# EAGLE design IOIO (EAGLE 5.11)
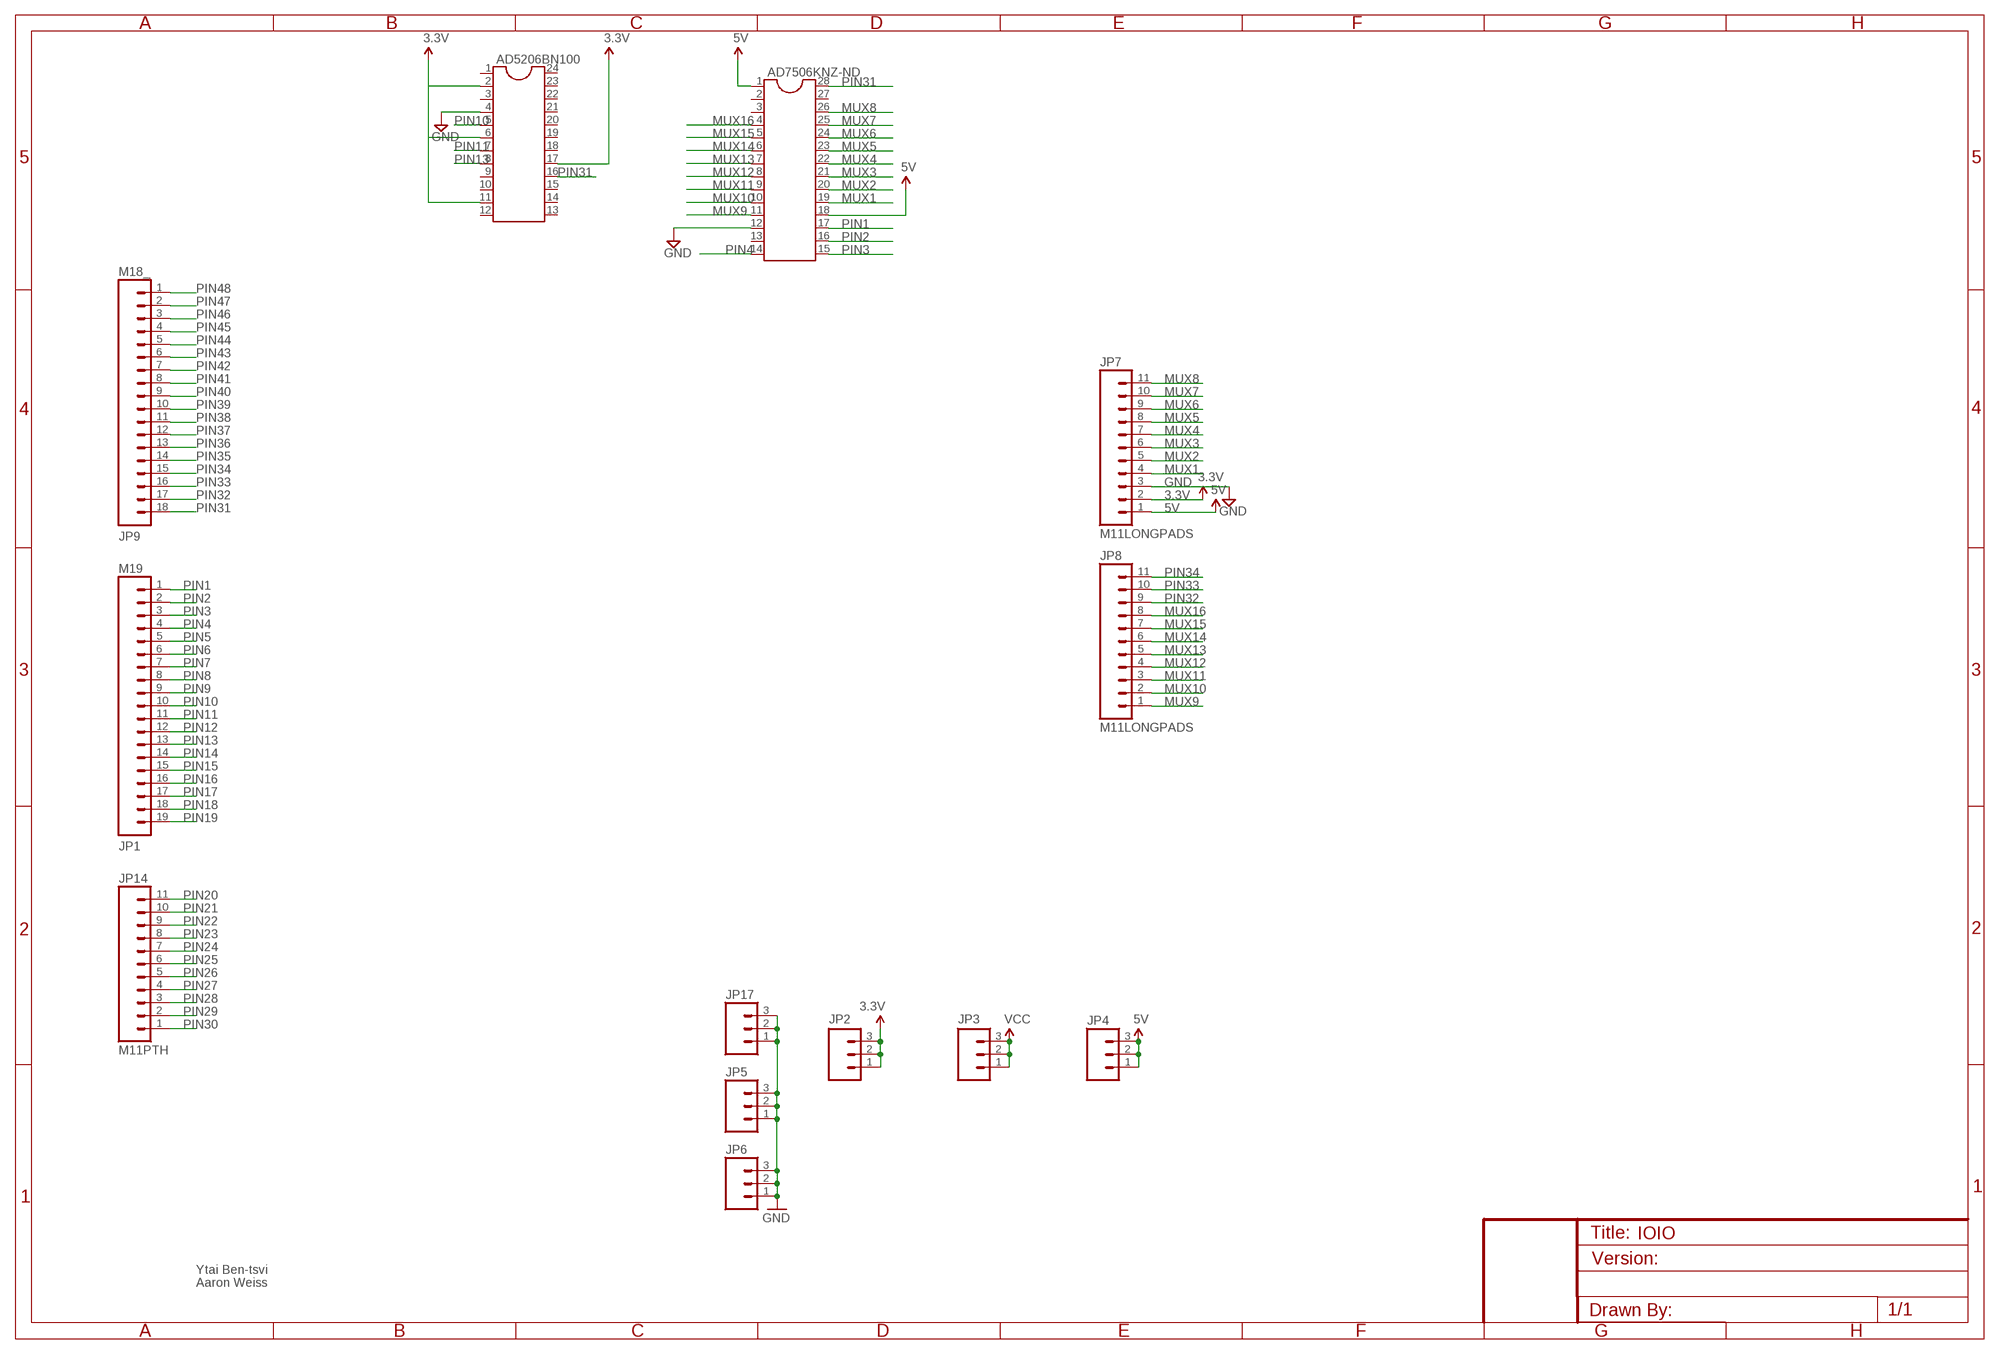
[diagram p0: schematic, sheet 1]

## Parts
AD5206BN100  DIL24-3  [DIL24-3]
AD7506KNZ-ND  DIL28  [DIL28-6]
JP1  M19  [1X19]
JP2  M03PTH  [1X03]
JP3  M03PTH  [1X03]
JP4  M03PTH  [1X03]
JP5  M03PTH  [1X03]
JP6  M03PTH  [1X03]
JP7  M11LONGPADS  [1X11_LONGPADS]
JP8  M11LONGPADS  [1X11_LONGPADS]
JP9  M18_  [1X18]
JP14  M11PTH  [1X11]
JP17  M03PTH  [1X03]

## Nets
3.3V: AD5206BN100.2 AD5206BN100.6 AD5206BN100.11 AD5206BN100.17 JP2.1 JP2.2 JP2.3 JP7.2
5V: AD7506KNZ-ND.1 AD7506KNZ-ND.18 JP4.1 JP4.2 JP4.3 JP7.1
GND: AD5206BN100.4 AD7506KNZ-ND.12 JP5.1 JP5.2 JP5.3 JP6.1 JP6.2 JP6.3 JP7.3 JP17.1 JP17.2 JP17.3
MUX1: AD7506KNZ-ND.19 JP7.4
MUX2: AD7506KNZ-ND.20 JP7.5
MUX3: AD7506KNZ-ND.21 JP7.6
MUX4: AD7506KNZ-ND.22 JP7.7
MUX5: AD7506KNZ-ND.23 JP7.8
MUX6: AD7506KNZ-ND.24 JP7.9
MUX7: AD7506KNZ-ND.25 JP7.10
MUX8: AD7506KNZ-ND.26 JP7.11
MUX9: AD7506KNZ-ND.11 JP8.1
MUX10: AD7506KNZ-ND.10 JP8.2
MUX11: AD7506KNZ-ND.9 JP8.3
MUX12: AD7506KNZ-ND.8 JP8.4
MUX13: AD7506KNZ-ND.7 JP8.5
MUX14: AD7506KNZ-ND.6 JP8.6
MUX15: AD7506KNZ-ND.5 JP8.7
MUX16: AD7506KNZ-ND.4 JP8.8
PIN1: AD7506KNZ-ND.17 JP1.1
PIN2: AD7506KNZ-ND.16 JP1.2
PIN3: AD7506KNZ-ND.15 JP1.3
PIN4: AD7506KNZ-ND.14 JP1.4
PIN5: JP1.5
PIN6: JP1.6
PIN7: JP1.7
PIN8: JP1.8
PIN9: JP1.9
PIN10: AD5206BN100.5 JP1.10
PIN11: AD5206BN100.7 JP1.11
PIN12: JP1.12
PIN13: AD5206BN100.8 JP1.13
PIN14: JP1.14
PIN15: JP1.15
PIN16: JP1.16
PIN17: JP1.17
PIN18: JP1.18
PIN19: JP1.19
PIN20: JP14.11
PIN21: JP14.10
PIN22: JP14.9
PIN23: JP14.8
PIN24: JP14.7
PIN25: JP14.6
PIN26: JP14.5
PIN27: JP14.4
PIN28: JP14.3
PIN29: JP14.2
PIN30: JP14.1
PIN31: AD5206BN100.16 AD7506KNZ-ND.28 JP9.18
PIN32: JP8.9 JP9.17
PIN33: JP8.10 JP9.16
PIN34: JP8.11 JP9.15
PIN35: JP9.14
PIN36: JP9.13
PIN37: JP9.12
PIN38: JP9.11
PIN39: JP9.10
PIN40: JP9.9
PIN41: JP9.8
PIN42: JP9.7
PIN43: JP9.6
PIN44: JP9.5
PIN45: JP9.4
PIN46: JP9.3
PIN47: JP9.2
PIN48: JP9.1
VCC: JP3.1 JP3.2 JP3.3
Unconnected: AD5206BN100.1 AD5206BN100.3 AD5206BN100.9 AD5206BN100.10 AD5206BN100.12 AD5206BN100.13 AD5206BN100.14 AD5206BN100.15 AD5206BN100.18 AD5206BN100.19 AD5206BN100.20 AD5206BN100.21 AD5206BN100.22 AD5206BN100.23 AD5206BN100.24 AD7506KNZ-ND.2 AD7506KNZ-ND.3 AD7506KNZ-ND.13 AD7506KNZ-ND.27

## Notes on the sheet
- Ytai Ben-tsvi
- Aaron Weiss

## Library data of the parts
AD5206BN100 = ic-package:DIL24: Dual In Line
AD7506KNZ-ND = ic-package:DIL28: Dual In Line
JP1 = SparkFun:M19
JP2-JP6 JP17 = SparkFun:M03: Header 3 Standard 3-pin 0.1" header. Use with straight break away headers (SKU : PRT-00116), right angle break away headers (PRT-00553), swiss pins (PRT-00743), machine pins (PRT-00117), and female headers (PRT-00115). Molex polarized connector foot print use with SKU : PRT-08232 with associated crimp pins and housings.
JP7 JP8 JP14 = SparkFun:M11: Header 11 Standard 11-pin 0.1" header. Use with straight break away headers (SKU : PRT-00116), right angle break away headers (PRT-00553), swiss pins (PRT-00743), machine pins (PRT-00117), and female headers (PRT-00115).
JP9 = SparkFun:M18

## Board
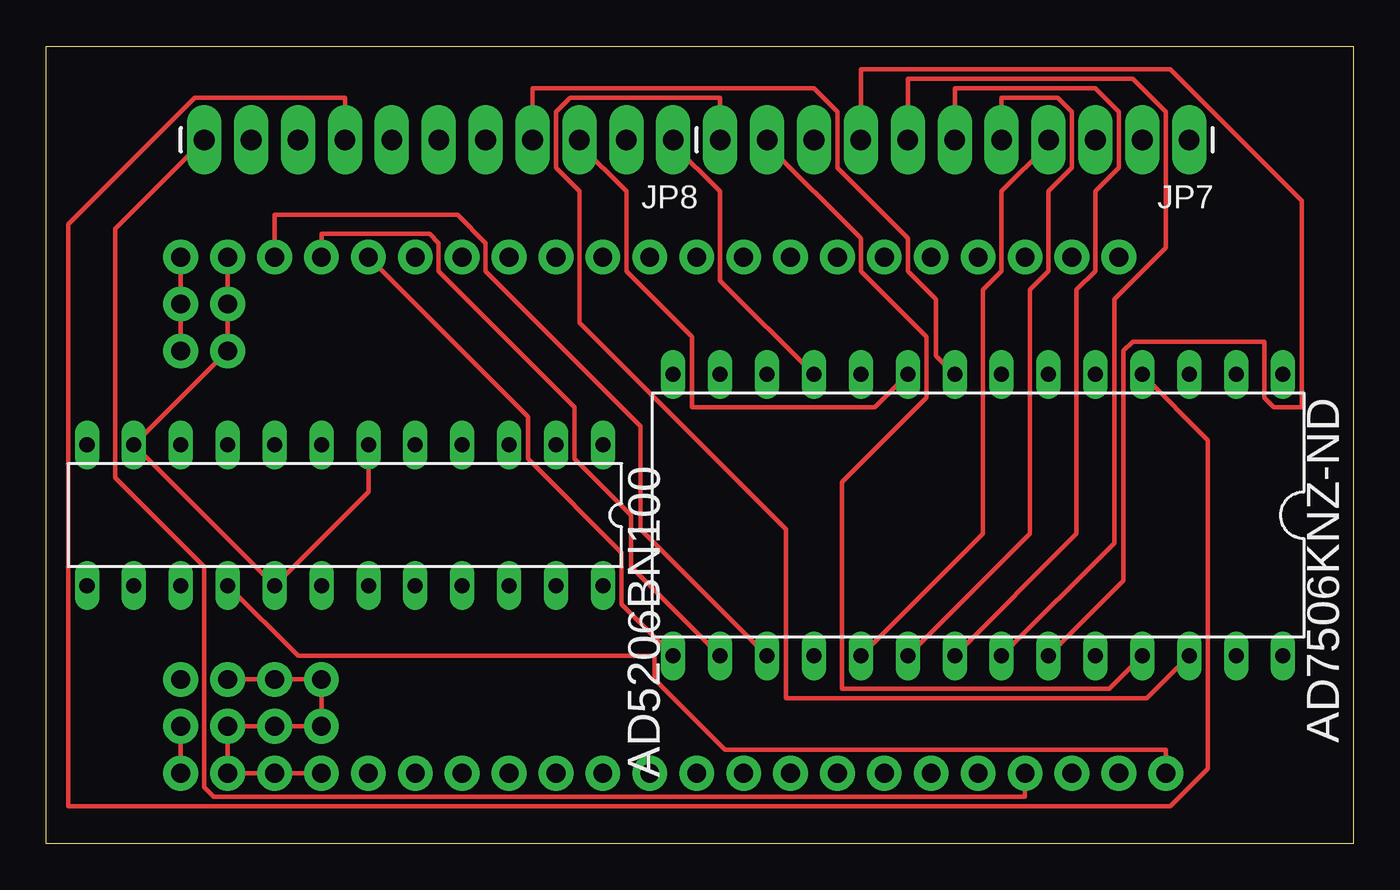
[diagram p1: board, top side]
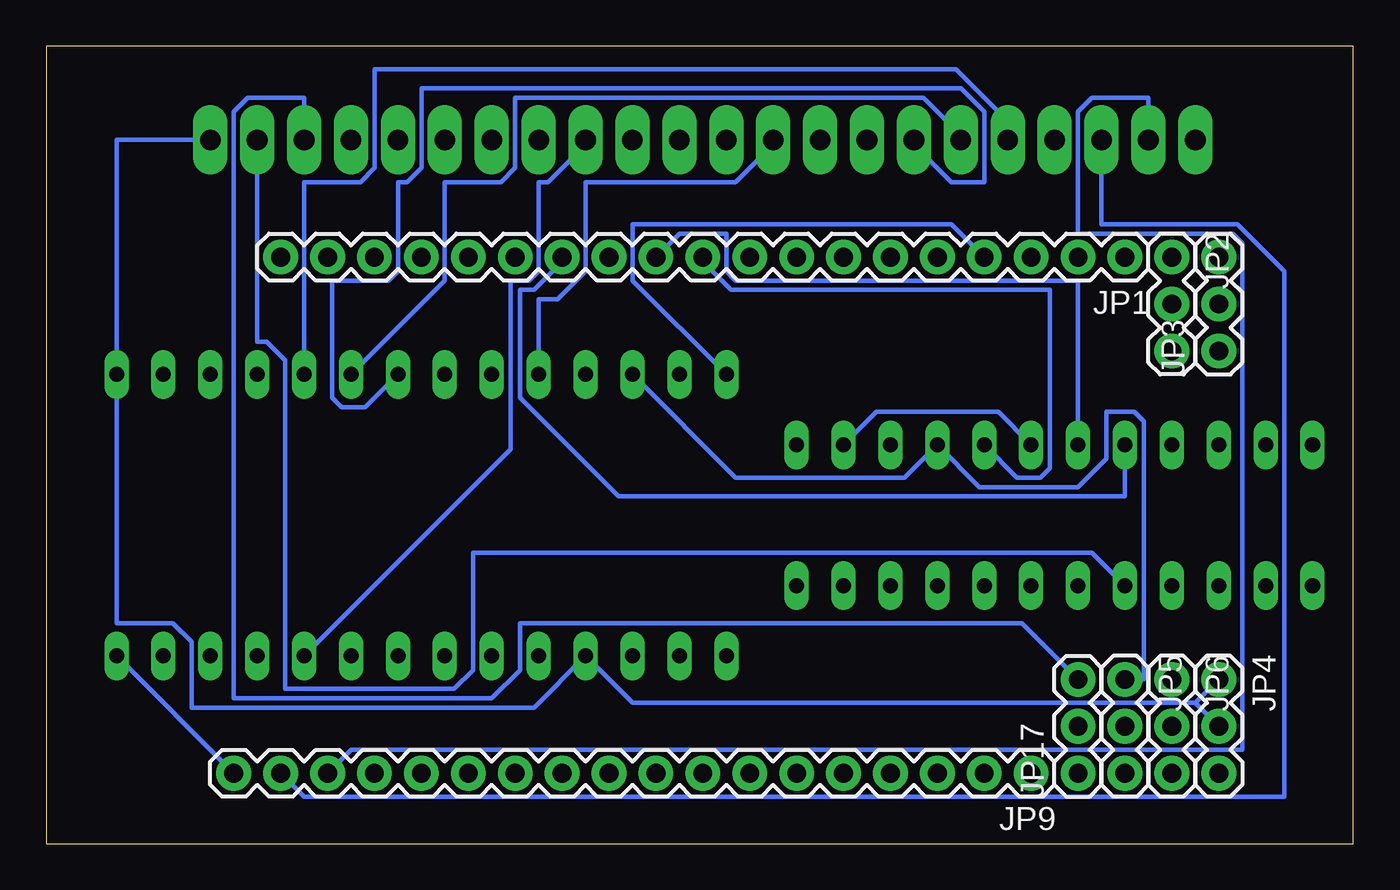
[diagram p2: board, bottom side, seen from below]

Size 70.79 x 43.17 mm. Coordinates in mm from the lower left corner, seen from the top.
Outline: 70.79,0 0,0 0,43.17 70.79,43.17 70.79,0
Copper layers (1*16): Top 0.035mm / dielectric 1.5mm / Bottom 0.035mm
Design rules "default": minimum track width 10mil, minimum drill 24mil, track to track 8mil, track to pad 8mil, pad to pad 8mil, via to via 8mil, smd to smd 8mil, copper to edge 40mil, drill to drill 8mil, minimum pad ring 10mil, minimum via ring 8mil, stop-mask expansion 4mil, vias tented up to drill 0mil, thermal gap 10mil

### Footprints (pad centres in the part's own frame; a part is rotated, then mirrored left to right if it is on the bottom)
DIL24-3 = drill 0.813 long: 1 -13.97,-3.81; 2 -11.43,-3.81; 3 -8.89,-3.81; 4 -6.35,-3.81; 5 -3.81,-3.81; 6 -1.27,-3.81; 7 1.27,-3.81; 8 3.81,-3.81; 9 6.35,-3.81; 10 8.89,-3.81; 11 11.43,-3.81; 12 13.97,-3.81; 13 13.97,3.81; 14 11.43,3.81; 15 8.89,3.81; 16 6.35,3.81; 17 3.81,3.81; 18 1.27,3.81; 19 -1.27,3.81; 20 -3.81,3.81; 21 -6.35,3.81; 22 -8.89,3.81; 23 -11.43,3.81; 24 -13.97,3.81
DIL28-6 = drill 0.813 long: 1 -16.51,-7.62; 2 -13.97,-7.62; 3 -11.43,-7.62; 4 -8.89,-7.62; 5 -6.35,-7.62; 6 -3.81,-7.62; 7 -1.27,-7.62; 8 1.27,-7.62; 9 3.81,-7.62; 10 6.35,-7.62; 11 8.89,-7.62; 12 11.43,-7.62; 13 13.97,-7.62; 14 16.51,-7.62; 15 16.51,7.62; 16 13.97,7.62; 17 11.43,7.62; 18 8.89,7.62; 19 6.35,7.62; 20 3.81,7.62; 21 1.27,7.62; 22 -1.27,7.62; 23 -3.81,7.62; 24 -6.35,7.62; 25 -8.89,7.62; 26 -11.43,7.62; 27 -13.97,7.62; 28 -16.51,7.62
1X19 = drill 1.016 pad 1.88 round: 1 0,0; 2 2.54,0; 3 5.08,0; 4 7.62,0; 5 10.16,0; 6 12.7,0; 7 15.24,0; 8 17.78,0; 9 20.32,0; 10 22.86,0; 11 25.4,0; 12 27.94,0; 13 30.48,0; 14 33.02,0; 15 35.56,0; 16 38.1,0; 17 40.64,0; 18 43.18,0; 19 45.72,0
1X03 = drill 1.016 pad 1.88 round: 1 0,0; 2 2.54,0; 3 5.08,0
1X11_LONGPADS = drill 1.118 pad 1.88 long: 1 0,0; 2 2.54,0; 3 5.08,0; 4 7.62,0; 5 10.16,0; 6 12.7,0; 7 15.24,0; 8 17.78,0; 9 20.32,0; 10 22.86,0; 11 25.4,0
1X18 = drill 1.016 pad 1.88 round: 1 0,0; 2 2.54,0; 3 5.08,0; 4 7.62,0; 5 10.16,0; 6 12.7,0; 7 15.24,0; 8 17.78,0; 9 20.32,0; 10 22.86,0; 11 25.4,0; 12 27.94,0; 13 30.48,0; 14 33.02,0; 15 35.56,0; 16 38.1,0; 17 40.64,0; 18 43.18,0
1X11 = drill 1.016 pad 1.88 round: 1 0,0; 2 2.54,0; 3 5.08,0; 4 7.62,0; 5 10.16,0; 6 12.7,0; 7 15.24,0; 8 17.78,0; 9 20.32,0; 10 22.86,0; 11 25.4,0

### Placement (x,y rotation side)
AD5206BN100  16.18,17.78 180 top
AD7506KNZ-ND  50.47,17.78 180 top
JP1  12.37,31.75 180 bottom
JP2  9.83,31.75 270 bottom
JP3  7.29,26.67 90 bottom
JP4  7.29,8.89 270 bottom
JP5  12.37,8.89 270 bottom
JP6  9.83,8.89 270 bottom
JP7  61.9,38.1 180 top
JP8  33.96,38.1 180 top
JP9  17.45,3.81 180 bottom
JP14  84.76,6.35 90 bottom  (outside the outline)
JP17  14.91,3.81 90 bottom

### Tracks (layer width: path | path; a pad name or v marks a point on that pad's centre or on a via)
3.3V
  Top 0.254: JP2.1 JP2.2 JP2.3 AD5206BN100.11 AD5206BN100.17 17.45,19.05 AD5206BN100.6
  Bottom 0.254: AD5206BN100.2 25.83,23.37 19.23,23.37 AD5206BN100.6 | JP7.2 59.36,27.18 58.85,27.18 57.84,26.16 57.84,8.38 48.69,8.38 47.68,9.4 47.68,15.75 14.15,15.75 AD5206BN100.17
5V
  Top 0.254: JP4.3 JP4.2
  Bottom 0.254: JP7.1 66.98,38.1 AD7506KNZ-ND.1 66.98,11.94 63.93,11.94 62.92,10.92 62.92,7.37 44.37,7.37 AD7506KNZ-ND.18 39.04,7.62 8.56,7.62 | 8.56,7.62 JP4.1 | JP4.2 8.56,7.62
GND
  Top 0.254: JP17.1 JP5.3 JP6.3 JP6.2 JP5.2 JP17.2 JP17.3 JP5.1 JP6.1
  Bottom 0.254: AD7506KNZ-ND.12 33.45,19.81 24.31,19.81 AD5206BN100.4 20.24,19.3 14.91,19.3 13.39,20.83 13.39,23.37 11.86,23.37 11.35,22.86 11.35,8.89 JP5.1 | JP7.3 56.82,40.39 59.87,40.39 60.63,39.62 60.63,7.87 46.66,7.87 45.14,9.4 45.14,11.94 17.96,11.94 JP17.3
MUX1
  Top 0.254: AD7506KNZ-ND.19 50.72,16.76 50.72,29.97 51.74,30.99 51.74,35.31 54.28,37.85 JP7.4
MUX2
  Top 0.254: AD7506KNZ-ND.20 53.26,16.76 53.26,29.97 54.28,30.99 54.28,35.31 55.55,36.58 55.55,39.62 54.79,40.39 51.74,40.39 JP7.5
MUX3
  Top 0.254: AD7506KNZ-ND.21 55.8,16.76 55.8,29.97 56.82,30.99 56.82,35.31 58.09,36.58 58.09,39.62 56.82,40.89 49.2,40.89 JP7.6
MUX4
  Top 0.254: AD7506KNZ-ND.22 57.84,16.26 57.84,29.46 60.63,32.26 60.63,39.62 58.85,41.4 46.66,41.4 JP7.7
MUX5
  Top 0.254: AD7506KNZ-ND.23 58.34,14.22 58.34,26.67 58.85,27.18 65.96,27.18 65.96,24.13 66.47,23.62 68,23.62 68,34.8 60.88,41.91 44.12,41.91 JP7.8
MUX6
  Bottom 0.254: AD7506KNZ-ND.24 45.64,21.34 45.64,30.48 44.63,30.48 44.12,30.99 44.12,35.81 43.61,35.81 41.58,37.85 JP7.9
MUX7
  Top 0.254: AD7506KNZ-ND.25 57.58,8.38 43.1,8.38 43.1,19.56 47.68,24.13 47.68,27.43 44.12,30.99 44.12,32.77 39.04,37.85 JP7.10
MUX8
  Top 0.254: AD7506KNZ-ND.26 59.61,7.87 40.06,7.87 40.06,17.02 28.88,28.19 28.88,35.31 27.61,36.58 27.61,39.62 28.37,40.39 36.5,40.39 JP7.11
MUX9
  Top 0.254: AD7506KNZ-ND.11 36.5,30.48 36.5,35.31 33.96,37.85 JP8.1
MUX10
  Bottom 0.254: AD7506KNZ-ND.10 44.12,29.46 43.1,29.46 41.58,30.99 41.58,35.81 33.45,35.81 31.42,37.85 JP8.2
MUX11
  Top 0.254: AD7506KNZ-ND.9 44.88,23.62 34.98,23.62 34.98,27.43 31.42,30.99 31.42,35.31 28.88,37.85 JP8.3
MUX12
  Top 0.254: AD7506KNZ-ND.8 48.18,26.42 48.18,29.46 46.66,30.99 46.66,32.77 42.85,36.58 42.85,39.62 41.58,40.89 26.34,40.89 JP8.4
MUX13
  Bottom 0.254: AD7506KNZ-ND.7 53.52,23.62 54.79,23.62 55.3,24.13 55.3,30.48 52.25,30.48 51.74,30.99 51.74,35.81 51.23,35.81 50.47,36.58 50.47,40.89 21.26,40.89 19.99,39.62 19.99,35.81 21.77,35.81 23.8,37.85 JP8.5
MUX14
  Bottom 0.254: AD7506KNZ-ND.6 49.2,30.48 49.2,35.81 46.15,35.81 45.39,36.58 45.39,40.39 23.29,40.39 21.26,38.35 JP8.6
MUX15
  Bottom 0.254: AD7506KNZ-ND.5 56.82,35.81 53.77,35.81 53.01,36.58 53.01,41.91 21.51,41.91 18.72,39.12 JP8.7
MUX16
  Top 0.254: AD7506KNZ-ND.4 62.92,21.84 62.92,4.06 60.88,2.03 1.19,2.03 1.19,33.53 8.05,40.39 16.18,40.39 JP8.8
PIN1
  Top 0.254: AD7506KNZ-ND.17 32.18,17.02 32.18,22.61 23.8,30.99 23.8,32.51 22.28,34.04 12.37,34.04 JP1.1
PIN2
  Top 0.254: AD7506KNZ-ND.16 31.67,14.99 31.67,17.78 28.63,20.83 28.63,23.62 21.26,30.99 21.26,32.51 20.75,33.02 14.91,33.02 JP1.2
PIN3
  Top 0.254: AD7506KNZ-ND.15 31.17,12.95 31.17,15.75 26.09,20.83 26.09,23.11 JP1.3
PIN4
  Bottom 0.254: AD7506KNZ-ND.14 39.04,30.48 39.04,33.53 21.77,33.53 JP1.4
PIN10
  Bottom 0.254: AD5206BN100.5 18.21,19.81 16.94,19.81 16.43,20.32 16.43,29.97 33.71,29.97 35.23,31.5 JP1.10
PIN11
  Bottom 0.254: AD5206BN100.7 14.91,30.48 33.45,30.48 33.96,30.99 33.96,33.02 36.5,33.02 JP1.11
PIN13
  Bottom 0.254: AD5206BN100.8 12.37,18.8 39.8,18.8 45.14,24.13 45.14,29.97 44.37,29.97 42.85,31.5 JP1.13
PIN31
  Top 0.254: AD5206BN100.16 13.64,10.16 32.94,10.16 32.94,8.89 36.75,5.08 60.63,5.08 JP9.18
  Bottom 0.254: JP9.18 AD7506KNZ-ND.28
PIN32
  Bottom 0.254: JP8.9 13.64,33.53 6.27,33.53 3.73,30.99 3.73,2.54 56.82,2.54 JP9.17
PIN33
  Bottom 0.254: JP8.10 11.1,40.39 14.15,40.39 14.91,39.62 14.91,33.02 6.53,33.02 6.02,32.51 6.02,5.08 54.28,5.08 JP9.16
PIN34
  Top 0.254: JP8.11 3.73,33.27 3.73,19.81 8.56,14.99 8.56,3.05 9.07,2.54 53.01,2.54 JP9.15
VCC
  Top 0.254: JP3.1 JP3.2 JP3.3